# Altium project MIIC - Master.PrjPcb
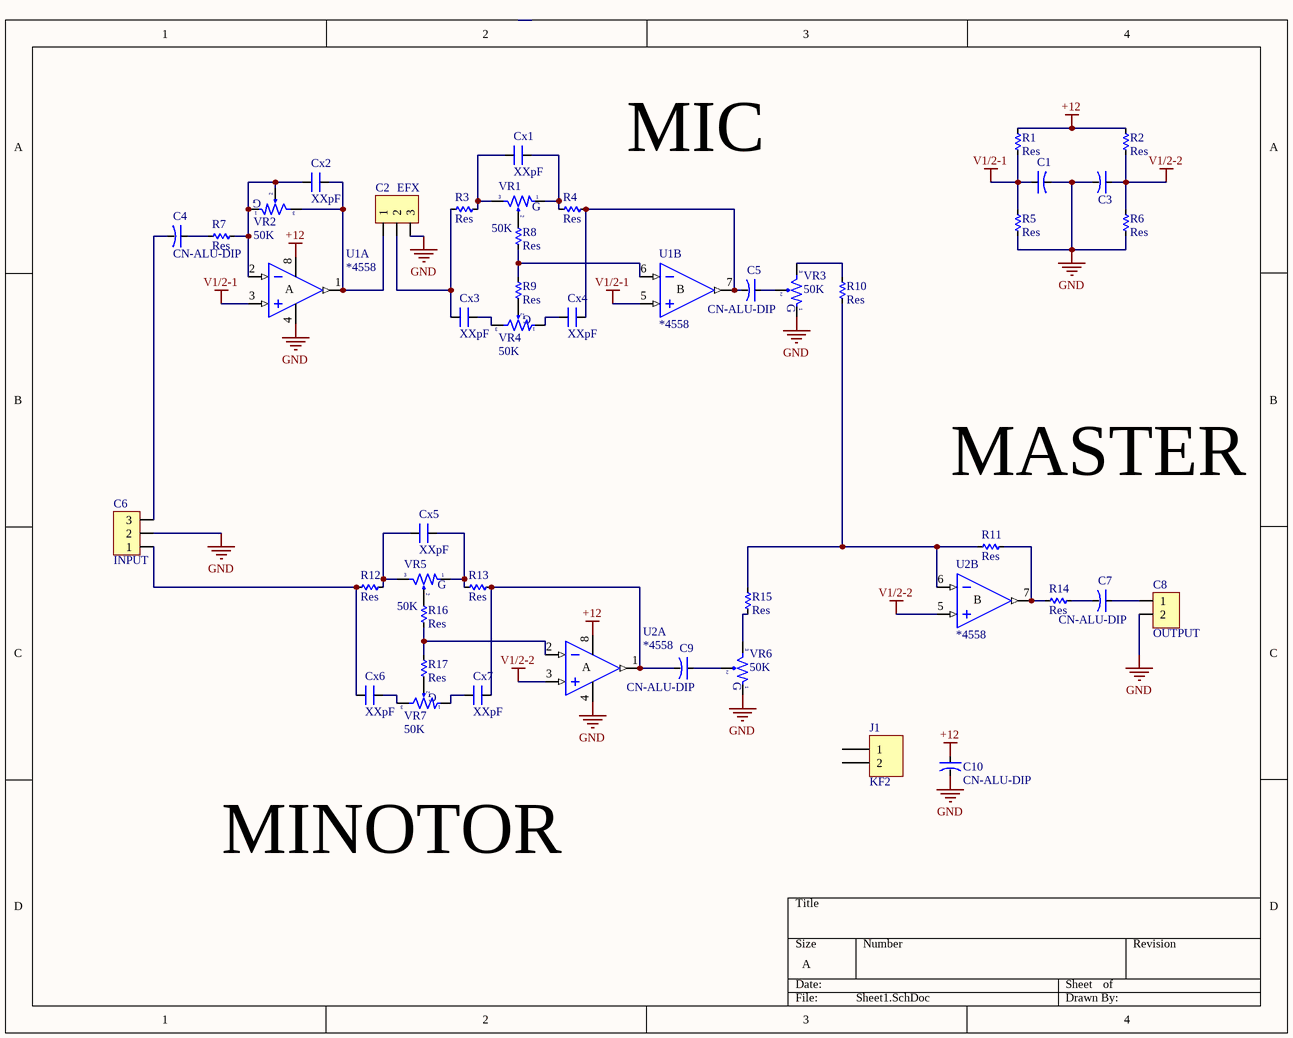
[diagram p0: Sheet1.SchDoc]
1 sheet, 44 parts. Net scope: global (net labels, ports and power ports of the same name join across sheets).
Board file: PCB1.PcbDoc

## Sheet Sheet1.SchDoc
size A; SheetNumber: 1; SheetTotal: 1

### Parts
C1  CN-ALU-DIP  [CA-ALU-5]  (value not drawn)
C2  EFX  [Header3]
C3  CN-ALU-DIP  [CA-ALU-5]  (value not drawn)
C4  CN-ALU-DIP  [CA-ALU-5]
C5  CN-ALU-DIP  [CA-ALU-5]
C6  INPUT  [Header3]
C7  CN-ALU-DIP  [CA-ALU-5]
C8  OUTPUT  [Header2]
C9  CN-ALU-DIP  [CA-ALU-5]
C10  CN-ALU-DIP  [CA-ALU-6.3R]
Cx1  XXpF  [CN2-O]
Cx2  XXpF  [CN1.5]
Cx3  XXpF  [CN2-O]
Cx4  XXpF  [CN1.5]
Cx5  XXpF  [CN2-O]
Cx6  XXpF  [CN1.5]
Cx7  XXpF  [CN1.5]
J1  KF2  [KF2-5.08]
R1  Res  [RES-1/4W-SMALL]
R2  Res  [RES-1/4W-SMALL]
R3  Res  [RES-1/4W-SMALL]
R4  Res  [RES-1/4W-SMALL]
R5  Res  [RES-1/4W-SMALL]
R6  Res  [RES-1/4W-SMALL]
R7  Res  [RES-1/4W-SMALL]
R8  Res  [RES-1/4W-SMALL]
R9  Res  [RES-1/4W-SMALL]
R10  Res  [RES-1/4W-SMALL]
R11  Res  [RES-1/4W-SMALL]
R12  Res  [RES-1/4W-SMALL]
R13  Res  [RES-1/4W-SMALL]
R14  Res  [RES-1/4W-SMALL]
R15  Res  [RES-1/4W-SMALL]
R16  Res  [RES-1/4W-SMALL]
R17  Res  [RES-1/4W-SMALL]
U1  *4558  [DIP8]  (parts A,B of 2)
U2  *4558  [DIP8]  (parts A,B of 2)
VR1  50K  [VR-S1]
VR2  50K  [VR-S2]
VR3  50K  [VR-S1]
VR4  50K  [VR-S1]
VR5  50K  [VR-S1]
VR6  50K  [VR-S1]
VR7  50K  [VR-S1]

### Nets
+12: C10.1 R1.1 R2.1 U1.8(V+) U2.8(V+)
GND: C1.2 C2.3 C3.2 C6.2 C8.2 C10.2 R5.2 R6.2 U1.4(V-) U2.4(V-) VR3.1 VR6.1
V1/2-1: C1.1 R1.2 R5.1 U1.3(IN+) U1.5(IN+)
V1/2-2: C3.1 R2.2 R6.1 U2.3(IN+) U2.5(IN+)
NetC2_1: C2.1 Cx2.2 U1.1(OUT) VR2.3
NetC2_2: C2.2 Cx3.1 R3.2
NetC4_1: C4.1 R7.2
NetC4_2: C4.2 C6.3
NetC5_1: C5.1 VR3.2
NetC5_2: C5.2 Cx4.2 R4.1 U1.7(OUT)
NetC6_1: C6.1 Cx6.1 R12.2
NetC7_1: C7.1 C8.1
NetC7_2: C7.2 R14.1
NetC9_1: C9.1 VR6.2
NetC9_2: C9.2 Cx7.2 R13.1 U2.1(OUT)
NetCx1_1: Cx1.1 R3.1 VR1.3
NetCx1_2: Cx1.2 R4.2 VR1.1
NetCx2_1: Cx2.1 R7.1 U1.2(IN-) VR2.1 VR2.2
NetCx3_2: Cx3.2 VR4.3
NetCx4_1: Cx4.1 VR4.1
NetCx5_1: Cx5.1 R12.1 VR5.3
NetCx5_2: Cx5.2 R13.2 VR5.1
NetCx6_2: Cx6.2 VR7.3
NetCx7_1: Cx7.1 VR7.1
NetR8_1: R8.1 VR1.2
NetR8_2: R8.2 R9.1 U1.6(IN-)
NetR9_2: R9.2 VR4.2
NetR10_1: R10.1 VR3.3
NetR10_2: R10.2 R11.2 R15.1 U2.6(IN-)
NetR11_1: R11.1 R14.2 U2.7(OUT)
NetR15_2: R15.2 VR6.3
NetR16_1: R16.1 VR5.2
NetR16_2: R16.2 R17.1 U2.2(IN-)
NetR17_2: R17.2 VR7.2

Not connected (* = marked no-connect by the designer): J1 1 2

### Notes on the sheet
- MIC
- MASTER
- MINOTOR
- (in symbol 4558, part A) A
- (in symbol 4558, part B) B
- (in symbol VR-S) G

### Library data of the parts
C1 C3-C5 C7 C9 C10 = CN-ALU-DIP: Capacitor (Semiconductor SIM Model); Value: 104; LatestRevisionDate: 17-Jul-2002; LatestRevisionNote: Re-released for DXP Platform.; PackageReference: C1206; Publisher: Altium Limited
C2 C6 = Header3: Header IDC, 3 x 1 Pin Vertical 2.54mm Pitch (Non-Boxed, Male); Manufacturer: W¨¹rth Elektronik eiSos GmbH; partNo: 613002143121; ComponentLink1 Description: Manufacturer; ComponentLink2 Description: Datasheet; NoPins: 02; Created Date: 29 March 2013; ComponentLink1URL: http://www.we-online.com; ComponentLink2URL: http://katalog.we-online.de/em/datasheet/6130xx143121.pdf; Created by: Karrer Zheng
C8 = Header2: Header IDC, 2 x 1 Pin Vertical 2.54mm Pitch (Non-Boxed, Male); Manufacturer: W¨¹rth Elektronik eiSos GmbH; partNo: 613002143121; ComponentLink1 Description: Manufacturer; ComponentLink2 Description: Datasheet; NoPins: 02; Created Date: 29 March 2013; ComponentLink1URL: http://www.we-online.com; ComponentLink2URL: http://katalog.we-online.de/em/datasheet/6130xx143121.pdf; Created by: Karrer Zheng
Cx1-Cx7 = CN: Value: 33pF
J1 = KF2: Manufacturer: Würth Elektronik eiSos GmbH; partNo: 691103110002; ComponentLink1 Description: Manufacturer; ComponentLink2 Description: Datasheet; NoPins: 2; Created Date: 29 October 2013; ComponentLink1URL: http://www.we-online.com; ComponentLink2URL: http://katalog.we-online.de/em/datasheet/6911031100xx.pdf; Created by: Karrer Zheng
R1-R17 = Res: Manufacturer: Generic Components; Class: Passive; SubClass: R; Published: 08/06/2000; Publisher: Altium Hobart Technology Centre
U1 U2 = 4558
VR1-VR7 = VR-S: Var Resistor; Value: Volume 50k